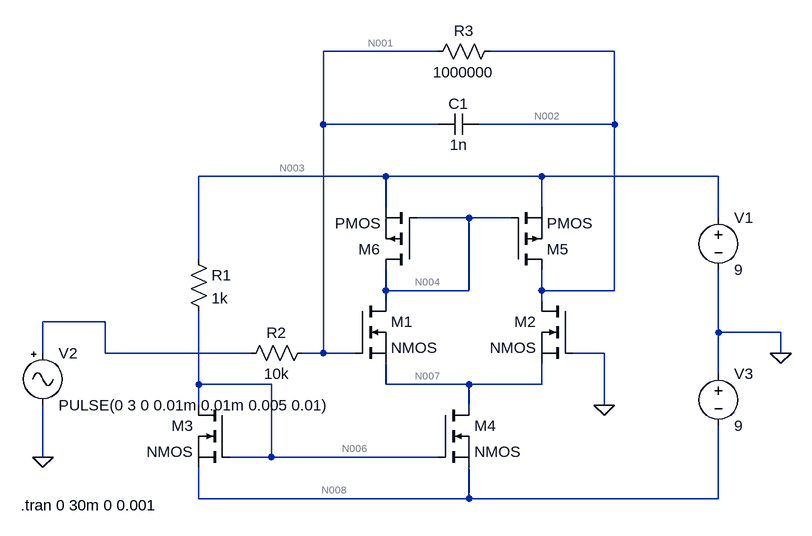
[diagram p0: schematic integrator.asc]
integrator.asc, the LTspice schematic file:
Version 4
SHEET 1 884 680
WIRE 304 -208 128 -208
WIRE 576 -208 384 -208
WIRE 128 -96 128 -208
WIRE 304 -96 128 -96
WIRE 576 -96 576 -208
WIRE 576 -96 368 -96
WIRE 224 -16 -64 -16
WIRE 464 -16 224 -16
WIRE 736 -16 464 -16
WIRE 224 32 224 -16
WIRE 464 32 464 -16
WIRE 352 48 272 48
WIRE 416 48 352 48
WIRE 736 48 736 -16
WIRE -64 112 -64 -16
WIRE 224 160 224 128
WIRE 352 160 352 48
WIRE 352 160 224 160
WIRE 464 160 464 128
WIRE 576 160 576 -96
WIRE 576 160 464 160
WIRE 224 176 224 160
WIRE 464 176 464 160
WIRE -208 208 -304 208
WIRE 736 224 736 128
WIRE 832 224 736 224
WIRE -304 256 -304 208
WIRE -208 256 -208 208
WIRE 16 256 -208 256
WIRE 128 256 128 -96
WIRE 128 256 96 256
WIRE 176 256 128 256
WIRE 560 256 512 256
WIRE 832 256 832 224
WIRE 736 288 736 224
WIRE -64 304 -64 192
WIRE 48 304 -64 304
WIRE 224 304 224 272
WIRE 352 304 224 304
WIRE 464 304 464 272
WIRE 464 304 352 304
WIRE -64 336 -64 304
WIRE 352 336 352 304
WIRE 560 336 560 256
WIRE -304 416 -304 336
WIRE 48 416 48 304
WIRE 48 416 -16 416
WIRE 304 416 48 416
WIRE -64 480 -64 432
WIRE 352 480 352 432
WIRE 352 480 -64 480
WIRE 736 480 736 368
WIRE 736 480 352 480
FLAG 832 256 0
FLAG -304 416 0
FLAG 560 336 0
SYMBOL nmos 176 176 R0
SYMATTR InstName M1
SYMBOL nmos 512 176 M0
SYMATTR InstName M2
SYMBOL nmos -16 336 M0
SYMATTR InstName M3
SYMBOL nmos 304 336 R0
SYMATTR InstName M4
SYMBOL res -80 96 R0
SYMATTR InstName R1
SYMATTR Value 1k
SYMBOL pmos 416 128 M180
SYMATTR InstName M5
SYMBOL pmos 272 128 R180
SYMATTR InstName M6
SYMBOL voltage 736 32 R0
WINDOW 123 0 0 Left 0
WINDOW 39 0 0 Left 0
SYMATTR InstName V1
SYMATTR Value 9
SYMBOL res 112 240 R90
WINDOW 0 0 56 VBottom 2
WINDOW 3 32 56 VTop 2
SYMATTR InstName R2
SYMATTR Value 10k
SYMBOL cap 368 -112 R90
WINDOW 0 0 32 VBottom 2
WINDOW 3 32 32 VTop 2
SYMATTR InstName C1
SYMATTR Value 1n
SYMBOL Misc\\signal -304 240 R0
WINDOW 123 0 0 Left 0
WINDOW 39 0 0 Left 0
SYMATTR InstName V2
SYMATTR Value PULSE(0 3 0 0.01m 0.01m 0.005 0.01)
SYMBOL voltage 736 272 R0
WINDOW 123 0 0 Left 0
WINDOW 39 0 0 Left 0
SYMATTR InstName V3
SYMATTR Value 9
SYMBOL res 400 -224 R90
WINDOW 0 0 56 VBottom 2
WINDOW 3 32 56 VTop 2
SYMATTR InstName R3
SYMATTR Value 1000000
TEXT -338 490 Left 2 !.tran 0 30m 0 0.001

The netlist it stands for:
* integrator.asc
M1 N004 N001 N007 N007 NMOS
M2 N002 0 N007 N007 NMOS
M3 N006 N006 N008 N008 NMOS
M4 N007 N006 N008 N008 NMOS
R1 N003 N006 1k
M5 N002 N004 N003 N003 PMOS
M6 N004 N004 N003 N003 PMOS
V1 N003 0 9
R2 N001 N005 10k
C1 N002 N001 1n
V2 N005 0 PULSE(0 3 0 0.01m 0.01m 0.005 0.01)
V3 0 N008 9
R3 N002 N001 1000000
.model NMOS NMOS
.model PMOS PMOS
.lib standard.mos
.tran 0 30m 0 0.001
.backanno
.end

* Results of the author's LTspice run, read from the files saved beside the schematic
* Operating Point, zero values left out:
*   V(n004) = 2.751 V
*   V(n001) = -441.1 nV
*   V(n007) = -6.249 V
*   V(n002) = -44.55 µV
*   V(n006) = 6.574 V
*   V(n008) = -9 V
*   V(n003) = 9 V
*   Id(M6) = -390.6 µA
*   Ib(M6) = 6.259 pA
*   Is(M6) = 390.6 µA
*   Id(M5) = -390.6 µA
*   Ib(M5) = 9.01 pA
*   Is(M5) = 390.6 µA
*   Id(M4) = 781.1 µA
*   Ib(M4) = -2.761 pA
*   Is(M4) = -781.1 µA
*   Id(M3) = 2.426 mA
*   Ib(M3) = -15.58 pA
*   Is(M3) = -2.426 mA
*   Id(M2) = 390.6 µA
*   Ib(M2) = -6.259 pA
*   Is(M2) = -390.6 µA
*   Id(M1) = 390.6 µA
*   Ib(M1) = -9.01 pA
*   Is(M1) = -390.6 µA
*   I(R3) = -44.11 pA
*   I(R2) = -44.11 pA
*   I(R1) = 2.426 mA
*   I(V3) = -3.207 mA
*   I(V2) = -44.11 pA
*   I(V1) = -3.207 mA